# Altium schematic sheet master-pcb.SchDoc
size A4
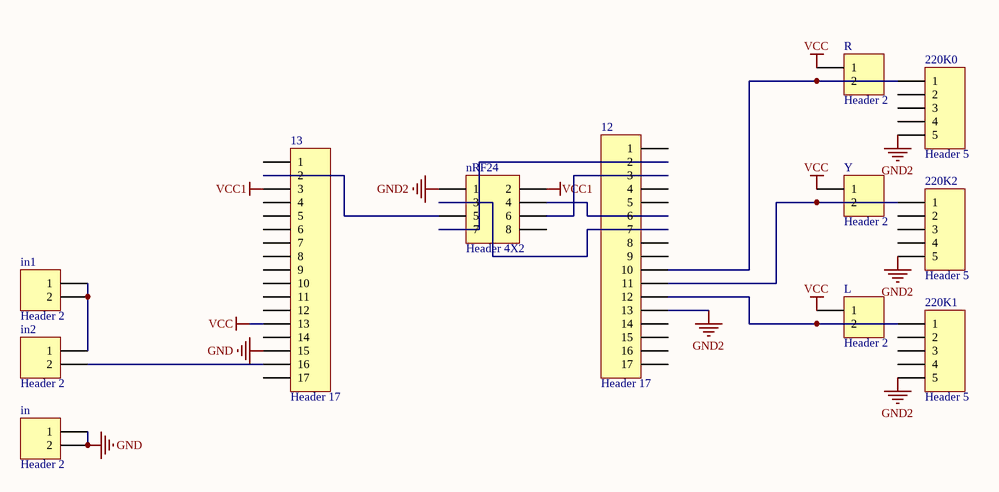
[diagram p0: master-pcb.SchDoc]

## Parts
12  Header 17  [HDR1X17]
13  Header 17  [HDR1X17]
220K0  Header 5  [HDR1X5]
220K1  Header 5  [HDR1X5]
220K2  Header 5  [HDR1X5]
in  Header 2  [HDR1X2]
in1  Header 2  [HDR1X2]
in2  Header 2  [HDR1X2]
L  Header 2  [HDR1X2]
nRF24  Header 4X2  [HDR2X4]
R  Header 2  [HDR1X2]
Y  Header 2  [HDR1X2]

## Nets
GND: 13.15 in.1 in.2
GND2: 12.13 220K0.5 220K1.5 220K2.5 nRF24.1
VCC: 13.13 L.1 R.1 Y.1
VCC1: 13.3 nRF24.2
Net12_2: 12.2 nRF24.7
Net12_3: 12.3 nRF24.6
Net12_6: 12.6 nRF24.4
Net12_7: 12.7 nRF24.3
Net12_10: 12.10 220K0.1 R.2
Net12_11: 12.11 220K2.1 Y.2
Net12_12: 12.12 220K1.1 L.2
Net13_2: 13.2 nRF24.5
Net13_16: 13.16 in2.2
Netin1_1: in1.1 in1.2 in2.1

Not connected (* = marked no-connect by the designer): 12 1 4 5 8 9 14 15 16 17; 13 1 4 5 6 7 8 9 10 11 12 14 17; 220K0 2 3 4; 220K1 2 3 4; 220K2 2 3 4; nRF24 8

## Library data of the parts
12 13 = Header 17: Header, 17-Pin; LatestRevisionDate: 17-Jul-2002; LatestRevisionNote: Re-released for DXP Platform.; Publisher: Altium Limited
220K0-220K2 = Header 5: Header, 5-Pin; LatestRevisionDate: 17-Jul-2002; LatestRevisionNote: Re-released for DXP Platform.; Publisher: Altium Limited
in in1 in2 L R Y = Header 2: Header, 2-Pin; LatestRevisionDate: 17-Jul-2002; LatestRevisionNote: Re-released for DXP Platform.; Publisher: Altium Limited
nRF24 = Header 4X2: Header, 4-Pin, Dual row; LatestRevisionDate: 17-Jul-2002; LatestRevisionNote: Re-released for DXP Platform.; Publisher: Altium Limited